# Altium schematic sheet Multiplexer.SchDoc
size A4; SheetNumber: 3; SheetTotal: 4
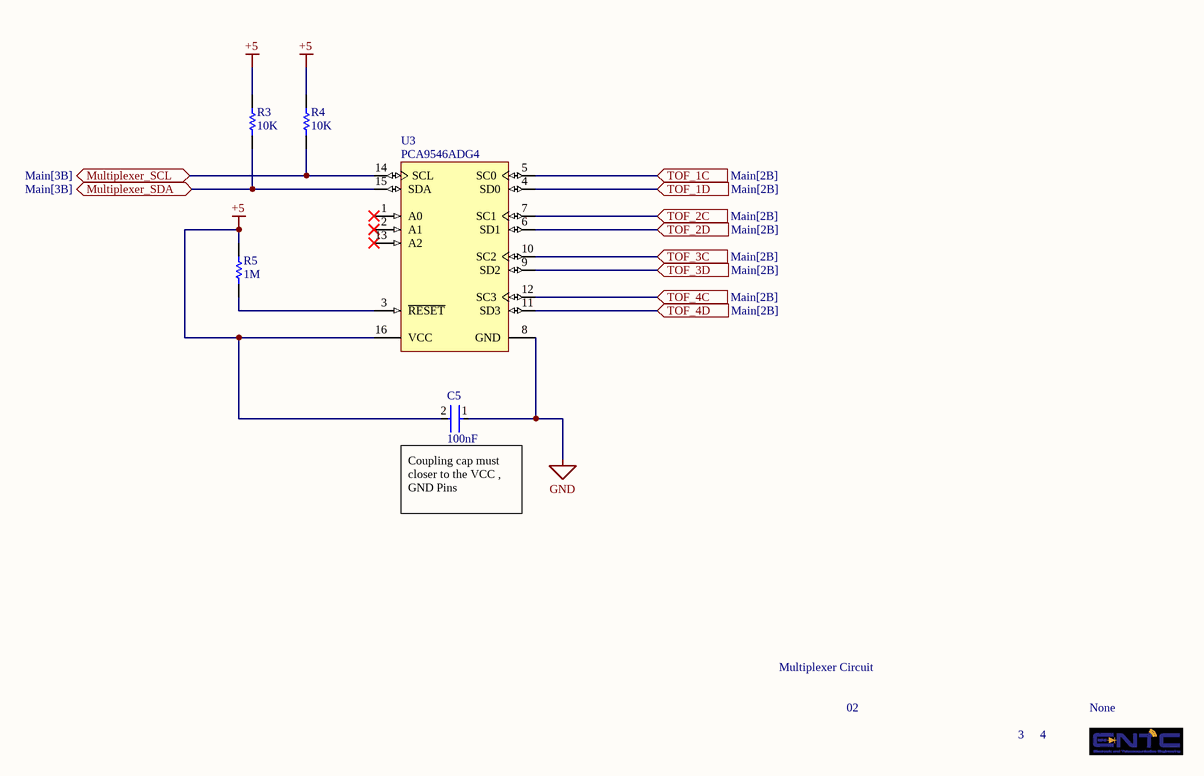
[diagram p0: Multiplexer.SchDoc]

## Parts
C5  100nF  [FP-C1206C-EB-MFG]
R3  10K  [RESC2013X60X35ML10T20]
R4  10K  [RESC2013X60X35ML10T20]
R5  1M  [RESC2013X60X35ML10T20]
U3  PCA9546ADG4  [D16_M]

## Ports
Multiplexer_SCL (bidir, see Main[3B]), Multiplexer_SDA (bidir, see Main[3B]), TOF_1C (in, see Main[2B]), TOF_1D (in, see Main[2B]), TOF_2C (in, see Main[2B]), TOF_2D (in, see Main[2B]), TOF_3C (in, see Main[2B]), TOF_3D (in, see Main[2B]), TOF_4C (in, see Main[2B]), TOF_4D (in, see Main[2B])

## Nets
+5: C5.2 R3.2 R4.2 R5.2 U3.16(VCC)
GND: C5.1 U3.8(GND)
Multiplexer_SCL: R4.1 U3.14(SCL) ; port Multiplexer_SCL
Multiplexer_SDA: R3.1 U3.15(SDA) ; port Multiplexer_SDA
TOF_1C: U3.5(SC0) ; port TOF_1C
TOF_1D: U3.4(SD0) ; port TOF_1D
TOF_2C: U3.7(SC1) ; port TOF_2C
TOF_2D: U3.6(SD1) ; port TOF_2D
TOF_3C: U3.10(SC2) ; port TOF_3C
TOF_3D: U3.9(SD2) ; port TOF_3D
TOF_4C: U3.12(SC3) ; port TOF_4C
TOF_4D: U3.11(SD3) ; port TOF_4D
NetR5_1: R5.1 U3.3(~{RESET})

Not connected (* = marked no-connect by the designer): U3 1(A0)* 2(A1)* 13(A2)*

## Notes on the sheet
- (near C5) Coupling cap must closer to the VCC , GND Pins
- Multiplexer Circuit
- 02
- 3
- 4
- None

## Library data of the parts
C5 = CMP-1037-04222-2: CAP CER 0.1UF 200V 10% X7R 1206; Manufacturer Part Number: C1206C104K2RACTU; Manufacturer: KEMET; Automotive Grade: Grade 0; Tolerance: 0.1; Value: 0.10 μF; Material: Ceramic; Temperature Coefficient: 15%; Automotive: Yes; Temperature Characteristic: X7R; Digikey Description: CAP CER 0.1UF 200V 10% X7R 1206; ComponentLink2URL: https://content.kemet.com/datasheets/KEM_C1007_X8R_ULTRA_150C_SMD.pdf; Voltage Rating: 200 V; Temperature Range High: +150°C; Device Class L1: Passive Components; Octopart: https://octopart.com/c1206c104k2ractu-kemet-9138344; Temperature: -55°C to +150°C; Height: 0.88mm; Device Class L3: Ceramic Capacitors; Lead Free: Yes; Package: C1206C-EB; Category: Cap; Temperature Range Low: -55°C; Mouser Description: Multilayer Ceramic Capacitors MLCC - SMD/SMT 200volts 0.1uF X7R 10%; Ipc Land Pattern Name: CAPC320160X78; Capacitance: 0.10 μF; RoHS: TRUE; ComponentLink2Description: Datasheet; Device Class L2: Capacitors
R3-R5 = CMP-2100-03673-1: Chip Resistor, 0 Ohm, Jumper, +/- 5%, 0.125 W, -55 to 155 degC, 0805 (2012 Metric), RoHS, Tape and Reel; Manufacturer: Yageo; Power Rating: 125mW; Resistance: 0mOhm; Voltage Rating (DC): 150V; Temperature Coefficient: 200ppm/degreesC; Height: 0.5mm; Depth: 1.25mm; Case Code (Imperial): 0805; Lead Free: LeadFree; Military Standard: Not; Package Description: 2-Pin Surface Mounted Device, Body 2 x 1.25 mm; Case Code (Metric): 2012; Composition: ThickFilm; Voltage Rating: 150V; Manufacturer URL: http://www.yageo.com/; Packaging: TapeandReel; Package Reference: 0805; REACH SVHC: Unknown; Tolerance: 5%; Case/Package: 0805; Max Operating Temperature: 155degC; Number of Pins: 2; Min Operating Temperature: -55degC; RoHSCompliant: true; Length: 2mm; Datasheet URL: http://www.yageo.com/NewPortal/yageodocoutput?fileName=/pdf/R-Chip/PYu-RC_Group_51_RoHS_L_5.pdf; Termination: SMD/SMT; Radiation Hardening: No; Width: 1.25mm; Contact Plating: Tin; Datasheet Version: Rev. 5, 10/2016
U3 = CMP-0314-00094-1: 4-Channel I2C and SMBus Multiplexer with Reset Functions, 2.3 to 5.5 V, -40 to 85 degC, 16-pin SOIC (D), Green (RoHS & no Sb/Br); Manufacturer: Texas Instruments; Open Drain I/O Type: Yes; fSCLK(Max)(MHz): 100, 400; VCC(Min)(V): 2.3; Channel Width: 4; VCC(Max)(V): 5.5; tpd max(ns): 0.3, 1; Simultaneously Active Channels: 1 to 4; I2C Address: 1110 xxx; Max Frequency(kHz): 400; SubFamily: I2C Multiplexer, Switch; PartNumber: PCA9546ADG4; PackageVersion: revM, Jun-2011; Eco-Plan: Green (RoHS & no Sb/Br); ComponentLink1URL: http://www.ti.com/general/docs/lit/getliterature.tsp?genericPartNumber=PCA9546A&fileType=pdf; PackageDescription: 16-Pin Plastic Small Outline Integrated Circuit, 9.9 x 3.9 mm, Pitch 1.27 mm Pitch; Vcc range(V): 2.3 to 5.5; Reset Input: Yes; ComponentLink1Description: Datasheet; 5V Tolerant I/O: Yes; Code_JEDEC: MS-012AC; PackageReference: D16; DatasheetVersion: SCPS148E; ComponentLink2URL: http://www.ti.com/litv/pdf/mpds178g; ComponentLink2Description: Package Specification; Mounting Technology: Surface Mount